# EAGLE design toggleswitch (EAGLE 7.2.0)
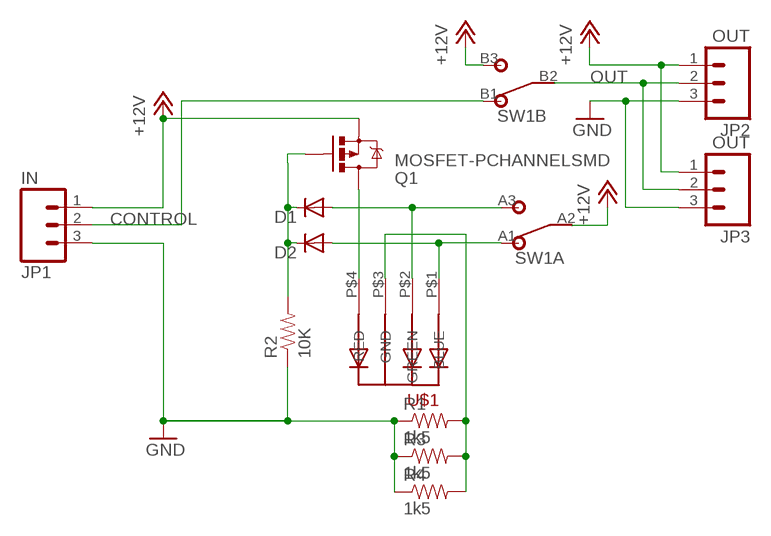
[diagram p0: schematic, sheet 1]

## Parts
D1  DIODE-MINIMELF  [MINIMELF]
D2  DIODE-MINIMELF  [MINIMELF]
JP1  IN  M03POLAR_LOCK  [MOLEX-1X3_LOCK]
JP2  OUT  M03POLAR_LOCK  [MOLEX-1X3_LOCK]
JP3  OUT  M03POLAR_LOCK  [MOLEX-1X3_LOCK]
Q1  MOSFET-PCHANNELSMD  [SOT23-3]
R1  1k5  RESISTOR0603-RES  [0603-RES]
R2  10K  RESISTOR0603-RES  [0603-RES]
R3  1k5  RESISTOR0603-RES  [0603-RES]
R4  1k5  RESISTOR0603-RES  [0603-RES]
SW1  DPDT  [DPDT]
U$1  5MMRGBLED  [LED5MMRGB]

## Nets
+12V: JP1.1 JP2.1 JP3.1 Q1.2(S) SW1.A2 SW1.B3
CONTROL: JP1.2 SW1.B1
GND: JP1.3 JP2.3 JP3.3 R1.1 R2.1 R3.1 R4.1
N$1: R1.2 R3.2 R4.2 U$1.P$3(GND)
N$3: D1.C D2.C Q1.1(G) R2.2
N$4: D1.A SW1.A3 U$1.P$2(GREEN)
N$5: D2.A SW1.A1 U$1.P$1(BLUE)
N$6: Q1.3(D) U$1.P$4(RED)
OUT: JP2.2 JP3.2 SW1.B2

## Library data of the parts
D1 D2 = diode:DIODE-: DIODE
JP1-JP3 = SparkFun:M03: Header 3 Standard 3-pin 0.1" header. Use with straight break away headers (SKU : PRT-00116), right angle break away headers (PRT-00553), swiss pins (PRT-00743), machine pins (PRT-00117), and female headers (PRT-00115). Molex polarized connector foot print use with SKU : PRT-08232 with associated crimp pins and housings.
Q1 = SparkFun-DiscreteSemi:MOSFET-PCHANNEL: Generic PMOSFET
R1-R4 = SparkFun:RESISTOR: Resistor Basic schematic elements and footprints for 0603, 1206, and PTH 1/10th watt (small) resistors.
SW1 = switches:DPDT
U$1 = led_rgb:5MMRGBLED

## Board
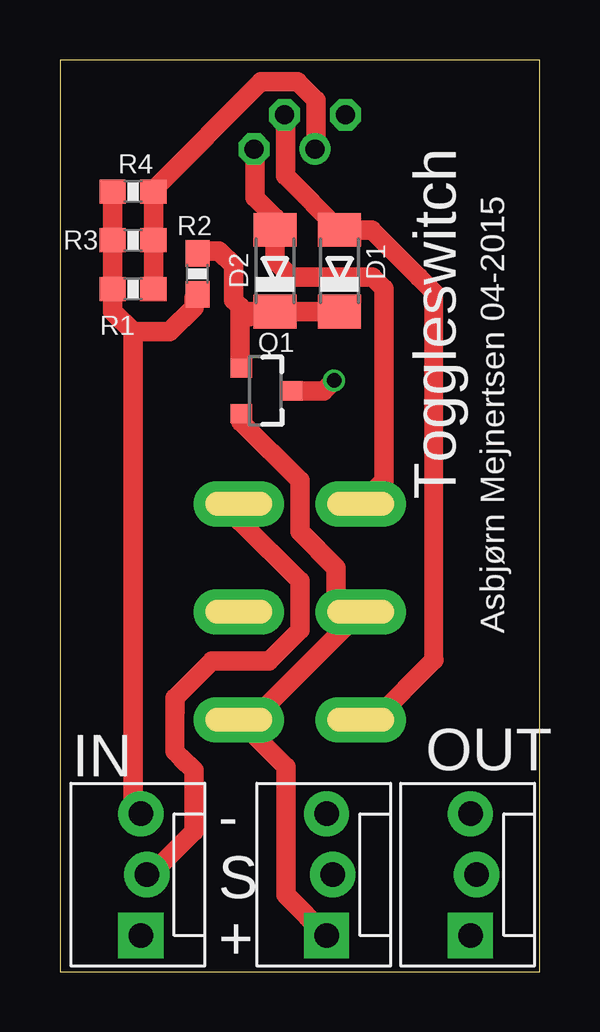
[diagram p1: board, top side]
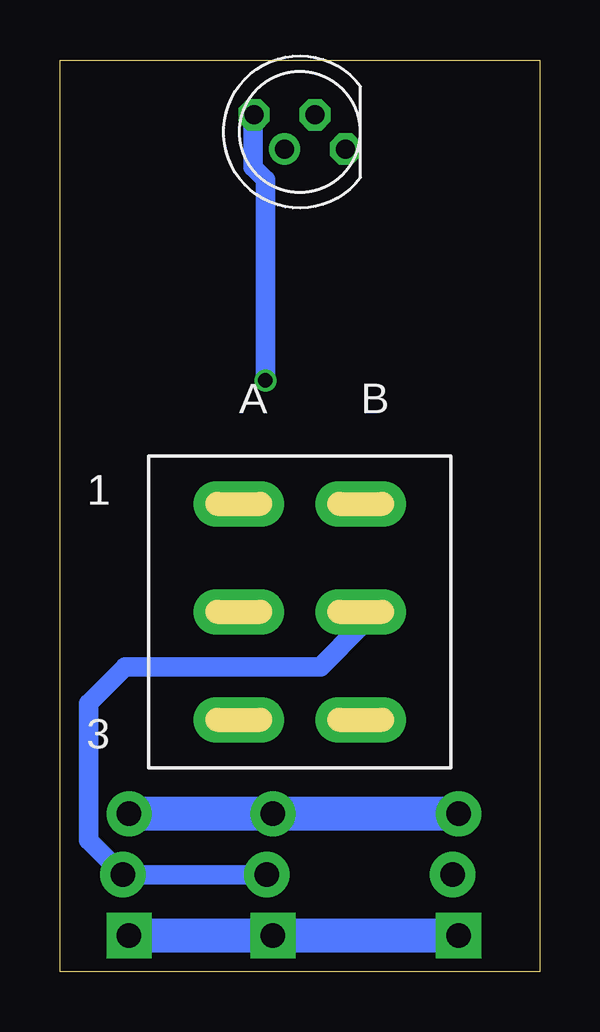
[diagram p2: board, bottom side, seen from below]

Size 20 x 38 mm. Coordinates in mm from the lower left corner, seen from the top.
Outline: 0,0 20,0 20,38 0,38 0,0
Copper layers (1*16): Top 0.035mm / dielectric 1.5mm / Bottom 0.035mm
Design rules "default *": minimum track width 6mil, minimum drill 12mil, track to track 6mil, track to pad 6mil, pad to pad 6mil, via to via 6mil, smd to smd 0mil, copper to edge 10mil, drill to drill 10mil, minimum pad ring 10mil, minimum via ring 6mil, stop-mask expansion 2mil, vias tented up to drill 100mil, thermal gap 10mil

### Footprints (pad centres in the part's own frame; a part is rotated, then mirrored left to right if it is on the bottom)
MINIMELF = smd 1.4 x 1.8: A 1.7,0; C -1.7,0
MOLEX-1X3_LOCK = drill 1.016 pad 1.88 square: 1 0,0.127 | drill 1.016 pad 1.88: 2 2.54,-0.127; 3 5.08,0.127
SOT23-3 = smd 0.8 x 0.9: 1 -0.95,-1; 2 0.95,-1; 3 0,1.1
0603-RES = smd 1.1 x 1: 1 -0.85,0; 2 0.85,0
DPDT = drill 0.8 pad 1.9 long: A1 -2.54,4.5; A2 -2.54,0; A3 -2.54,-4.5; B1 2.54,4.5; B2 2.54,0; B3 2.54,-4.5
LED5MMRGB = drill 0.8 pad 0.813 octagon: P$1 -1.905,0.714; P$2 -0.635,-0.714; P$4 1.905,-0.714 | drill 0.8 pad 0.813: P$3 0.635,0.714

### Placement (x,y rotation side)
D1  11.66,29.21 90 top
D2  8.97,29.21 90 top
JP1  3.5,1.5 90 top
JP2  11.25,1.5 90 top
JP3  17.25,1.5 90 top
Q1  8.56,24.21 270 top
R1  3.05,28.45 0 top
R2  5.73,29.08 90 top
R3  3.05,30.48 0 top
R4  3.05,32.51 0 top
SW1  10,15 0 bottom
U$1  10,35 180 bottom

### Tracks (layer width: path | path; a pad name or v marks a point on that pad's centre or on a via)
+12V
  Top 0.406: 12.11,14.99 12.11,14.56
  Top 0.813: 12.11,14.56 SW1.A2 | 12.57,14.99 SW1.A2 | SW1.A2 12.54,14.99 11.68,14.99 11.52,14.99 11.52,16.83 10.01,18.34 10.01,20.46 7.56,22.91 Q1.2 | SW1.A2 8.04,10.5 SW1.B3 9.43,8.53 9.43,3.19 JP2.1
  Bottom 1.422: JP1.1 JP2.1 JP3.1
CONTROL
  Top 0.8: 5.08,8.89 4.8,9.17 4.8,10.85
  Top 0.813: 4.8,10.85 4.8,11.4 6.35,12.95 8.71,12.95 10.01,14.25 10.01,16.28 7.52,18.77 7.52,19.44 SW1.B1 | JP1.2 3.79,4.04 5.59,5.84 5.59,8.38 5.08,8.89
GND
  Top 0.813: R4.1 R3.1 R1.1 2.2,27.52 3.05,26.67 | 3.05,26.67 3.05,6.91 JP1.3 | 3.05,26.67 4.57,26.67 5.59,27.69 5.59,28.09 R2.1
  Bottom 1.422: JP1.3 JP2.3 JP3.3
N$1
  Top 0.813: R1.2 R3.2 R4.2 3.9,32.6 8.38,37.08 9.91,37.08 10.67,36.32 10.67,34.32 U$1.P$3
N$3
  Top 0.152: 5.79,30.02 R2.2
  Top 0.813: D1.C D2.C 7.72,27.51 | 7.51,27.72 7.24,27.99 7.24,29.44 6.64,30.03 5.73,30.03 R2.2 | 7.51,27.72 7.72,27.51 | 7.93,27.3 7.72,27.51 | Q1.1 7.51,25.21 7.51,27.72
N$4
  Top 0.152: SW1.A3 12.65,10.52 12.8,10.52 13.12,10.5
  Top 0.8: 15.6,12.98 15.6,28.32 14.96,28.96
  Top 0.813: 14.96,28.96 13.01,30.91 D1.A 9.4,33.17 9.4,35.56 9.37,35.59 U$1.P$2 | 15.6,12.98 13.12,10.5
N$5
  Top 0.813: SW1.A1 13.51,20.47 13.51,28.47 13.03,28.96 9.65,28.96 8.97,29.64 D2.A 8.97,31.42 8.13,32.26 8.13,34.25 U$1.P$1
N$6  (via drill 0.6)
  Top 0.813: Q1.3 11,24.21 v11.43,24.64
  Bottom 0.813: v11.43,24.64 11.43,33.02 11.94,33.53 11.94,35.68 U$1.P$4
OUT
  Bottom 0.813: SW1.B2 7.46,14.38 9.14,12.7 17.27,12.7 18.8,11.18 18.8,5.46 JP3.2 JP2.2 11.35,4.06

### Text on the board
tNames: Toggleswitch | Asbjørn Mejnertsen 04-2015 | IN | OUT | - | S | +